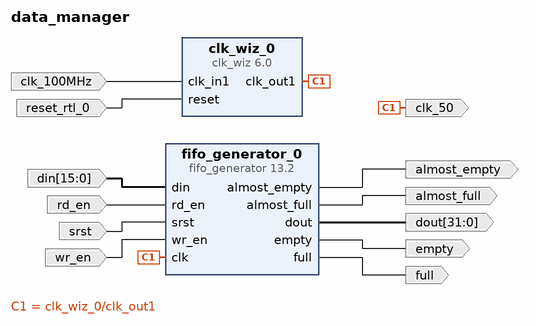
[diagram p0: block diagram of the top level]
# Vivado block design data_manager, xc7s50csga324-1, Vivado 2022.2
create_bd_design data_manager

create_bd_port -dir I -type clk clk_100MHz
set_property -dict {CONFIG.FREQ_HZ 100000000} [get_bd_ports clk_100MHz]
create_bd_port -dir I -type rst reset_rtl_0
set_property -dict {CONFIG.POLARITY ACTIVE_HIGH} [get_bd_ports reset_rtl_0]
create_bd_port -dir O full
create_bd_port -dir O almost_full
create_bd_port -dir O empty
create_bd_port -dir O almost_empty
create_bd_port -dir O -from 31 -to 0 -type data dout
create_bd_port -dir I wr_en
create_bd_port -dir I rd_en
create_bd_port -dir I -from 15 -to 0 -type data din
create_bd_port -dir I srst
create_bd_port -dir O -type clk clk_50

create_bd_cell -type ip -vlnv xilinx.com:ip:fifo_generator:13.2 fifo_generator_0
set_property -dict [list \
  CONFIG.Almost_Empty_Flag true \
  CONFIG.Almost_Full_Flag true \
  CONFIG.Input_Data_Width 16 \
] [get_bd_cells fifo_generator_0]
create_bd_cell -type ip -vlnv xilinx.com:ip:clk_wiz:6.0 clk_wiz_0
set_property -dict [list \
  CONFIG.CLKOUT1_JITTER 151.636 \
  CONFIG.CLKOUT1_REQUESTED_OUT_FREQ 50.000 \
  CONFIG.CLKOUT2_JITTER 151.636 \
  CONFIG.CLKOUT2_PHASE_ERROR 98.575 \
  CONFIG.CLKOUT2_REQUESTED_OUT_FREQ 50.000 \
  CONFIG.CLKOUT2_USED false \
  CONFIG.MMCM_CLKOUT0_DIVIDE_F 20.000 \
  CONFIG.MMCM_CLKOUT1_DIVIDE 1 \
  CONFIG.NUM_OUT_CLKS 1 \
] [get_bd_cells clk_wiz_0]

# ---- connections ----

connect_bd_net [get_bd_ports clk_100MHz] [get_bd_pins clk_wiz_0/clk_in1]
connect_bd_net [get_bd_pins clk_wiz_0/clk_out1] [get_bd_pins fifo_generator_0/clk] [get_bd_ports clk_50]
connect_bd_net [get_bd_ports din] [get_bd_pins fifo_generator_0/din]
connect_bd_net [get_bd_pins fifo_generator_0/almost_empty] [get_bd_ports almost_empty]
connect_bd_net [get_bd_pins fifo_generator_0/almost_full] [get_bd_ports almost_full]
connect_bd_net [get_bd_pins fifo_generator_0/dout] [get_bd_ports dout]
connect_bd_net [get_bd_pins fifo_generator_0/empty] [get_bd_ports empty]
connect_bd_net [get_bd_pins fifo_generator_0/full] [get_bd_ports full]
connect_bd_net [get_bd_ports rd_en] [get_bd_pins fifo_generator_0/rd_en]
connect_bd_net -net reset_rtl_0_1 [get_bd_ports reset_rtl_0] [get_bd_pins clk_wiz_0/reset]
connect_bd_net [get_bd_ports srst] [get_bd_pins fifo_generator_0/srst]
connect_bd_net [get_bd_ports wr_en] [get_bd_pins fifo_generator_0/wr_en]

validate_bd_design
save_bd_design
